# Altium project LED_Controller.PrjPcb
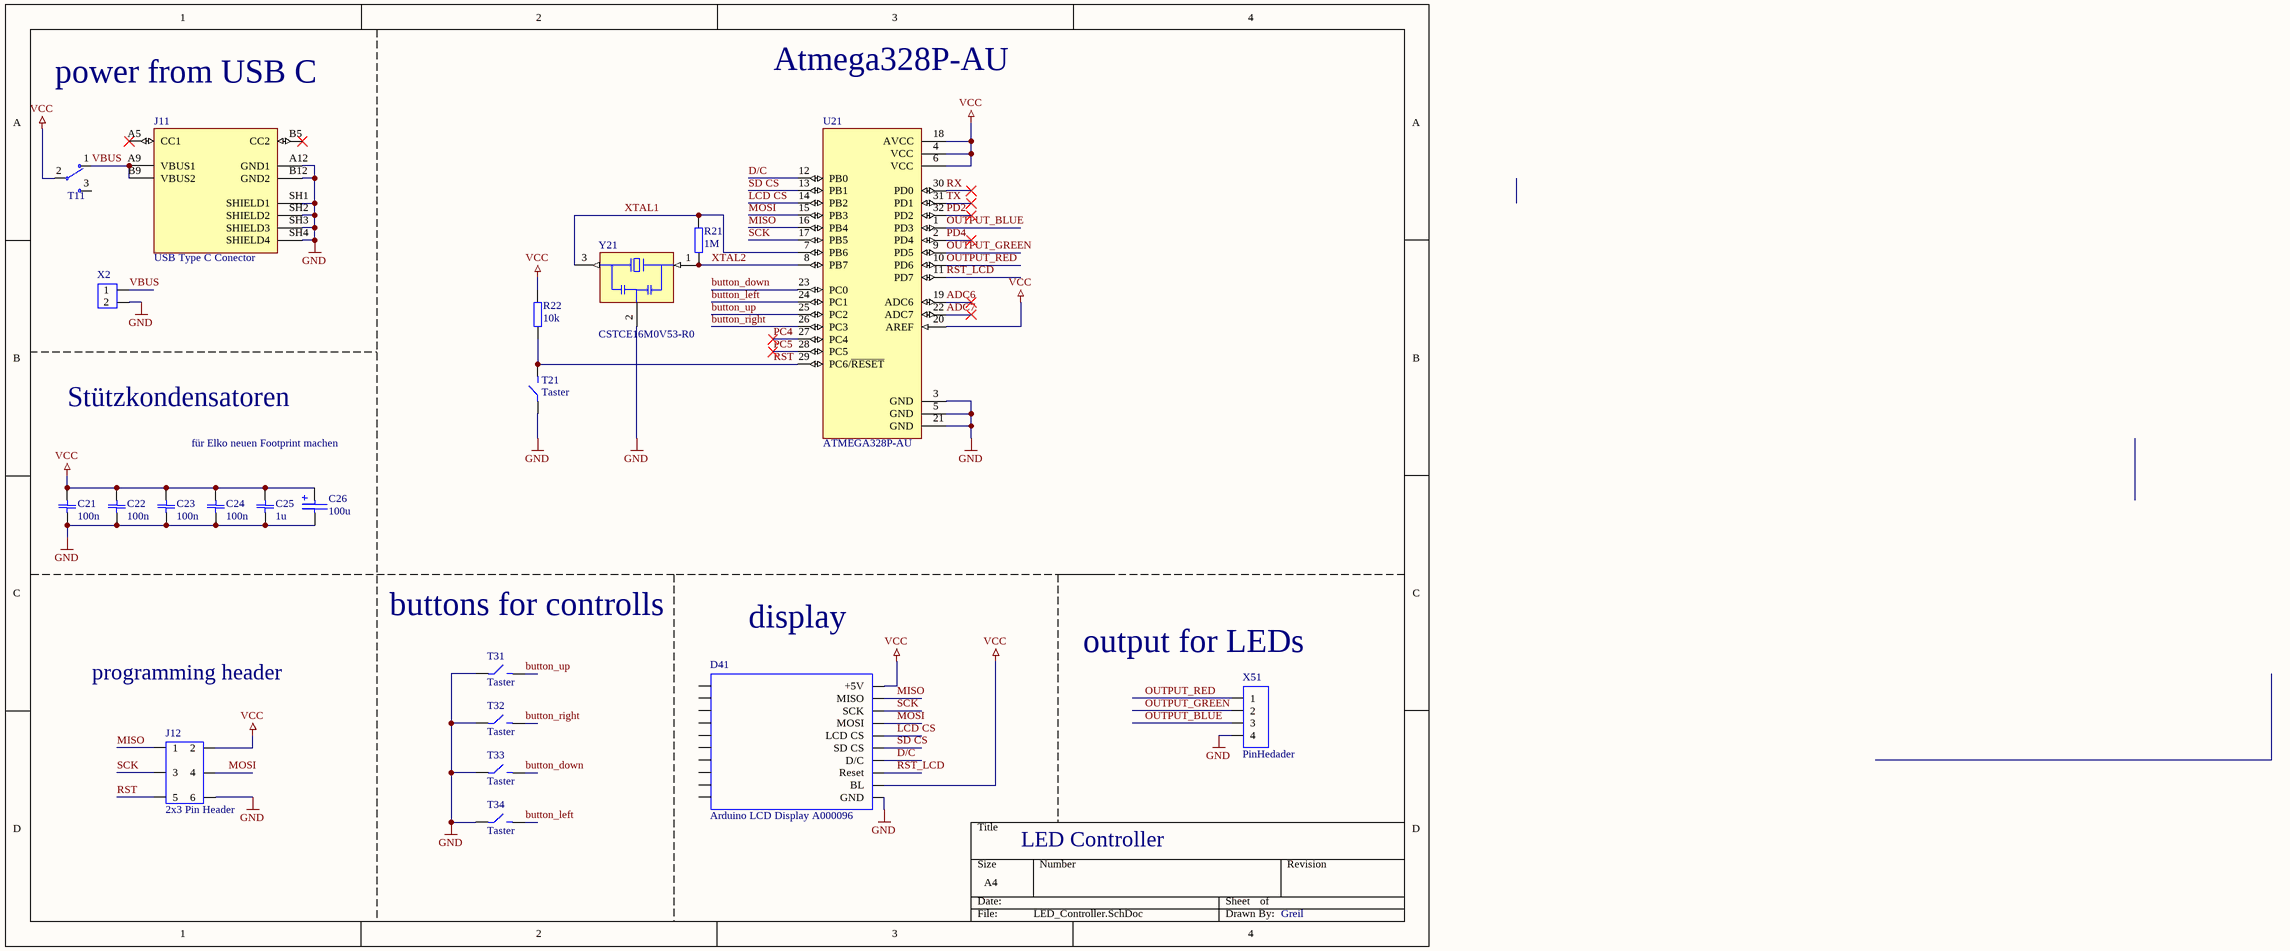
[diagram p0: LED_Controller.SchDoc]
1 sheet, 21 parts. Net scope: global (net labels, ports and power ports of the same name join across sheets).
Board file: LED_Controller.PcbDoc

## Sheet LED_Controller.SchDoc
size A4; SheetNumber: 1; SheetTotal: 1

### Parts
C21  100n  [CAP0805]
C22  100n  [CAP0805]
C23  100n  [CAP0805]
C24  100n  [CAP0805]
C25  1u  [CAP0805]
C26  100u  [ELKO_D5.0]
D41  Arduino LCD Display A000096  [Arduino LCD Display A000096]
J11  USB Type C Conector  [MOLEX_2171750001]
J12  2x3 Pin Header  [2x3 Pin Header]
R21  1M  [RES_ERJU08J154V]
R22  10k  [RES_ERJU08J154V]
T11  Toggel Switch  [Toggel Switch]  (value not drawn)
T21  Taster  [Taster]
T31  Taster  [Taster]
T32  Taster  [Taster]
T33  Taster  [Taster]
T34  Taster  [Taster]
U21  ATMEGA328P-AU  [QFP80P900X900X120-32N]
X2  PinHedader  [CON2]  (value not drawn)
X51  PinHedader  [CON4_200mil]
Y21  CSTCE16M0V53-R0  [OSC_CSTCE16M0V53-R0]

### Nets
GND: C21.1 C22.1 C23.1 C24.1 C25.1 C26.N D41.GND J11.A12(GND1) J11.B12(GND2) J11.SH1(SHIELD1) J11.SH2(SHIELD2) J11.SH3(SHIELD3) J11.SH4(SHIELD4) J12.6 T21.1 T31.1 T32.1 T33.1 T34.1 U21.3(GND) U21.5(GND) U21.21(GND) X2.2 X51.4 Y21.2(GND)
VCC: C21.2 C22.2 C23.2 C24.2 C25.2 C26.P D41.+5V D41.BL J12.2 R22.2 T11.2 U21.4(VCC) U21.6(VCC) U21.18(AVCC) U21.20(AREF)
ADC6: U21.19(ADC6)
ADC7: U21.22(ADC7)
button_down: T33.2 U21.23(PC0)
button_left: T34.2 U21.24(PC1)
button_right: T32.2 U21.26(PC3)
button_up: T31.2 U21.25(PC2)
D/C: D41.D/C U21.12(PB0)
LCD CS: D41.LCD_CS U21.14(PB2)
MISO: D41.MISO J12.1 U21.16(PB4)
MOSI: D41.MOSI J12.4 U21.15(PB3)
OUTPUT_BLUE: U21.1(PD3) X51.3
OUTPUT_GREEN: U21.9(PD5) X51.2
OUTPUT_RED: U21.10(PD6) X51.1
PC4: U21.27(PC4)
PC5: U21.28(PC5)
PD2: U21.32(PD2)
PD4: U21.2(PD4)
RST: J12.5 R22.1 T21.2 U21.29(PC6/~{RESET})
RST_LCD: D41.Reset U21.11(PD7)
RX: U21.30(PD0)
SCK: D41.SCK J12.3 U21.17(PB5)
SD CS: D41.SD_CS U21.13(PB1)
TX: U21.31(PD1)
VBUS: J11.A9(VBUS1) J11.B9(VBUS2) T11.1 X2.1
XTAL1: R21.2 U21.7(PB6) Y21.3(OUT)
XTAL2: R21.1 U21.8(PB7) Y21.1(IN)

Not connected (* = marked no-connect by the designer): D41 1 2 3 4 5 6 7 8 9 10; J11 A5(CC1)* B5(CC2)*; T11 3

### Notes on the sheet
- power from USB C
- Atmega328P-AU
- Stützkondensatoren
- für Elko neuen Footprint machen
- buttons for controlls
- display
- (near X51) output for LEDs
- programming header
- LED Controller
- Greil

### Library data of the parts
C21-C25 = SMD CAP: MP: VJ1206A220GXCAP; Package: None; Price: None; Availability: Unavailable
  C21-C24: Value: 100n
  C25: Value: 1u
C26 = ELKO: VALUE: 100u
J11 = USB Type C Conector: USB-C (USB TYPE-C) USB 2.0 Receptacle Connector 24 (6+18 Dummy) Position Surface Mount, Right Angle; Through Hole; MF: Molex; MP: 2171750001; SnapEDA_Link: https://www.snapeda.com/parts/2171750001/Molex/view-part/?ref=snap; Package: None; Value: *; Check_prices: https://www.snapeda.com/parts/2171750001/Molex/view-part/?ref=eda
R21 R22 = Res 1206: MP: ERJU08J154V; Package: None; Price: None; Availability: Unavailable
  R21: Value: 1M
  R22: Value: 10k
U21 = ATMEGA328P-AU: AVR AVRÂ® ATmega Microcontroller IC 8-Bit 20MHz 32KB (16K x 16) FLASH 32-TQFP (7x7); MF: Microchip Technology; SnapEDA_Link: https://www.snapeda.com/parts/ATMEGA328P-AU/Microchip/view-part/?ref=snap; Package: TQFP-32 Microchip; Value: *; MP: ATMEGA328P-AU; Check_prices: https://www.snapeda.com/parts/ATMEGA328P-AU/Microchip/view-part/?ref=eda
X2 = CON 2: VALUE: PinHedader
X51 = CON4: VALUE: PinHedader
Y21 = CSTCE16M0V53-R0: 16 MHz Ceramic Resonator Built in Capacitor 15 pF Â±0.3% -20Â°C ~ 80Â°C Surface Mount; MF: Murata; Value: 16MHz; Price: None; Package: SMD-3 Murata; Purchase-URL: https://pricing.snapeda.com/search/part/CSTCE16M0V53-R0/?ref=eda; Availability: In Stock; SnapEDA_Link: https://www.snapeda.com/parts/CSTCE16M0V53-R0/Murata+Electronics+North+America/view-part/?ref=snap; MP: CSTCE16M0V53-R0; Check_prices: https://www.snapeda.com/parts/CSTCE16M0V53-R0/Murata+Electronics+North+America/view-part/?ref=eda
T21 T31-T34 = Taster: Value: Taster